# EAGLE design Test Board (EAGLE 9.2.0)
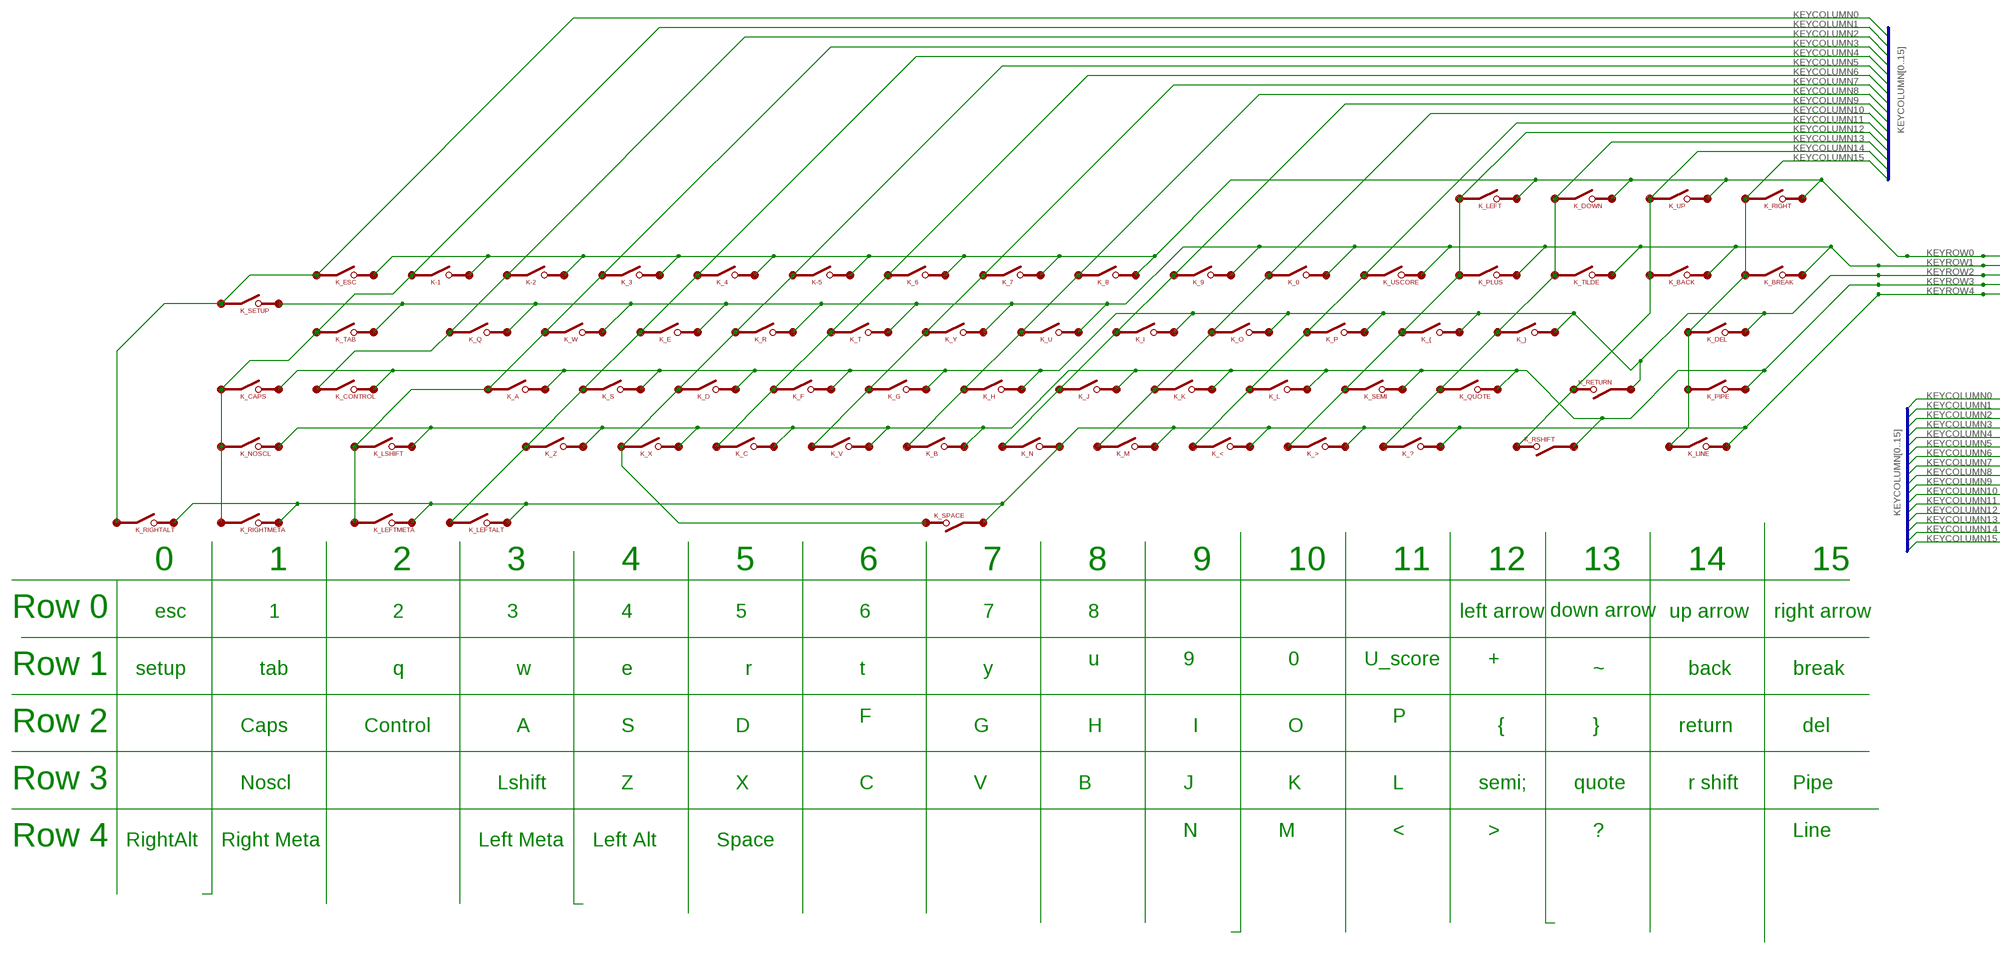
[diagram p0: schematic, sheet 1, part 1 of 2]
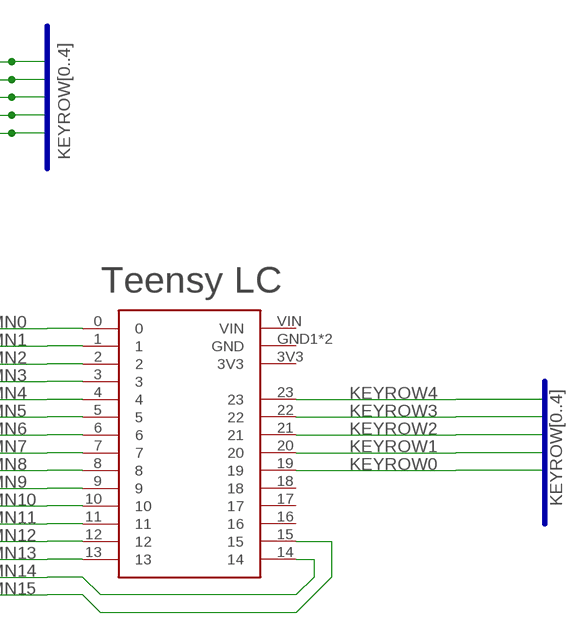
[diagram p1: schematic, sheet 1, part 2 of 2]

## Parts
K-1  1U_PAD  [SILICONE_SWITCH]
K-2  1U_PAD  [SILICONE_SWITCH]
K-5  1U_PAD  [SILICONE_SWITCH]
K_0  1U_PAD  [SILICONE_SWITCH]
K_3  1U_PAD  [SILICONE_SWITCH]
K_4  1U_PAD  [SILICONE_SWITCH]
K_6  1U_PAD  [SILICONE_SWITCH]
K_7  1U_PAD  [SILICONE_SWITCH]
K_8  1U_PAD  [SILICONE_SWITCH]
K_9  1U_PAD  [SILICONE_SWITCH]
K_<  1U_PAD  [SILICONE_SWITCH]
K_>  1U_PAD  [SILICONE_SWITCH]
K_?  1U_PAD  [SILICONE_SWITCH]
K_A  1U_PAD  [SILICONE_SWITCH]
K_B  1U_PAD  [SILICONE_SWITCH]
K_BACK  1U_PAD  [SILICONE_SWITCH]
K_BREAK  1U_PAD  [SILICONE_SWITCH]
K_C  1U_PAD  [SILICONE_SWITCH]
K_CAPS  1U_PAD  [SILICONE_SWITCH]
K_CONTROL  2U_PAD  [SILICONE_SWITCH_2U]
K_D  1U_PAD  [SILICONE_SWITCH]
K_DEL  1U_PAD  [SILICONE_SWITCH]
K_DOWN  1U_PAD  [SILICONE_SWITCH]
K_E  1U_PAD  [SILICONE_SWITCH]
K_ESC  1U_PAD  [SILICONE_SWITCH]
K_F  1U_PAD  [SILICONE_SWITCH]
K_G  1U_PAD  [SILICONE_SWITCH]
K_H  1U_PAD  [SILICONE_SWITCH]
K_I  1U_PAD  [SILICONE_SWITCH]
K_J  1U_PAD  [SILICONE_SWITCH]
K_K  1U_PAD  [SILICONE_SWITCH]
K_L  1U_PAD  [SILICONE_SWITCH]
K_LEFT  1U_PAD  [SILICONE_SWITCH]
K_LEFTALT  1U_PAD  [SILICONE_SWITCH]
K_LEFTMETA  1U_PAD  [SILICONE_SWITCH]
K_LINE  1U_PAD  [SILICONE_SWITCH]
K_LSHIFT  2U_PAD  [SILICONE_SWITCH_2U]
K_M  1U_PAD  [SILICONE_SWITCH]
K_N  1U_PAD  [SILICONE_SWITCH]
K_NOSCL  1U_PAD  [SILICONE_SWITCH]
K_O  1U_PAD  [SILICONE_SWITCH]
K_P  1U_PAD  [SILICONE_SWITCH]
K_PIPE  1U_PAD  [SILICONE_SWITCH]
K_PLUS  1U_PAD  [SILICONE_SWITCH]
K_Q  1U_PAD  [SILICONE_SWITCH]
K_QUOTE  1U_PAD  [SILICONE_SWITCH]
K_R  1U_PAD  [SILICONE_SWITCH]
K_RETURN  RETURN_PAD  [SILICONE_RETURN]
K_RIGHT  1U_PAD  [SILICONE_SWITCH]
K_RIGHTALT  1U_PAD  [SILICONE_SWITCH]
K_RIGHTMETA  1U_PAD  [SILICONE_SWITCH]
K_RSHIFT  2U_PAD  [SILICONE_SWITCH_2U]
K_S  1U_PAD  [SILICONE_SWITCH]
K_SEMI  1U_PAD  [SILICONE_SWITCH]
K_SETUP  2U_PAD  [SILICONE_SWITCH_2U]
K_SPACE  SPACE_PAD  [SILICONE_SPACE]
K_T  1U_PAD  [SILICONE_SWITCH]
K_TAB  1U_PAD  [SILICONE_SWITCH]
K_TILDE  1U_PAD  [SILICONE_SWITCH]
K_U  1U_PAD  [SILICONE_SWITCH]
K_UP  1U_PAD  [SILICONE_SWITCH]
K_USCORE  1U_PAD  [SILICONE_SWITCH]
K_V  1U_PAD  [SILICONE_SWITCH]
K_W  1U_PAD  [SILICONE_SWITCH]
K_X  1U_PAD  [SILICONE_SWITCH]
K_Y  1U_PAD  [SILICONE_SWITCH]
K_Z  1U_PAD  [SILICONE_SWITCH]
K_{  1U_PAD  [SILICONE_SWITCH]
K_}  1U_PAD  [SILICONE_SWITCH]
U$1  TEENSYLC  [2X14]

## Nets
KEYCOLUMN0: K_ESC.P$2 K_RIGHTALT.P$2 K_SETUP.P$2 U$1.0
KEYCOLUMN1: K-1.P$2 K_CAPS.P$2 K_NOSCL.P$2 K_RIGHTMETA.P$2 K_TAB.P$2 U$1.1
KEYCOLUMN2: K-2.P$2 K_CONTROL.P$2 K_Q.P$2 U$1.2
KEYCOLUMN3: K_3.P$2 K_A.P$2 K_LEFTMETA.P$2 K_LSHIFT.P$2 K_W.P$2 U$1.3
KEYCOLUMN4: K_4.P$2 K_E.P$2 K_LEFTALT.P$2 K_S.P$2 K_Z.P$2 U$1.4
KEYCOLUMN5: K-5.P$2 K_D.P$2 K_R.P$2 K_SPACE.P$1 K_X.P$2 U$1.5
KEYCOLUMN6: K_6.P$2 K_C.P$2 K_F.P$2 K_T.P$2 U$1.6
KEYCOLUMN7: K_7.P$2 K_G.P$2 K_V.P$2 K_Y.P$2 U$1.7
KEYCOLUMN8: K_8.P$2 K_B.P$2 K_H.P$2 K_U.P$2 U$1.8
KEYCOLUMN9: K_9.P$2 K_I.P$2 K_J.P$2 K_N.P$2 U$1.9
KEYCOLUMN10: K_0.P$2 K_K.P$2 K_M.P$2 K_O.P$2 U$1.10
KEYCOLUMN11: K_<.P$2 K_L.P$2 K_P.P$2 K_USCORE.P$2 U$1.11
KEYCOLUMN12: K_>.P$2 K_LEFT.P$2 K_PLUS.P$2 K_SEMI.P$2 K_{.P$2 U$1.12
KEYCOLUMN13: K_?.P$2 K_DOWN.P$2 K_QUOTE.P$2 K_TILDE.P$2 K_}.P$2 U$1.13
KEYCOLUMN14: K_BACK.P$2 K_RETURN.P$1 K_RSHIFT.P$1 K_UP.P$2 U$1.14
KEYCOLUMN15: K_BREAK.P$2 K_DEL.P$2 K_LINE.P$2 K_PIPE.P$2 K_RIGHT.P$2 U$1.15
KEYROW0: K-1.P$1 K-2.P$1 K-5.P$1 K_3.P$1 K_4.P$1 K_6.P$1 K_7.P$1 K_8.P$1 K_DOWN.P$1 K_ESC.P$1 K_LEFT.P$1 K_RIGHT.P$1 K_UP.P$1 U$1.19
KEYROW1: K_0.P$1 K_9.P$1 K_BACK.P$1 K_BREAK.P$1 K_E.P$1 K_PLUS.P$1 K_Q.P$1 K_R.P$1 K_SETUP.P$1 K_T.P$1 K_TAB.P$1 K_TILDE.P$1 K_U.P$1 K_USCORE.P$1 K_W.P$1 K_Y.P$1 U$1.20
KEYROW2: K_A.P$1 K_CAPS.P$1 K_CONTROL.P$1 K_D.P$1 K_DEL.P$1 K_F.P$1 K_G.P$1 K_H.P$1 K_I.P$1 K_O.P$1 K_P.P$1 K_RETURN.P$2 K_S.P$1 K_{.P$1 K_}.P$1 U$1.21
KEYROW3: K_B.P$1 K_C.P$1 K_J.P$1 K_K.P$1 K_L.P$1 K_LSHIFT.P$1 K_NOSCL.P$1 K_PIPE.P$1 K_QUOTE.P$1 K_RSHIFT.P$2 K_SEMI.P$1 K_V.P$1 K_X.P$1 K_Z.P$1 U$1.22
KEYROW4: K_<.P$1 K_>.P$1 K_?.P$1 K_LEFTALT.P$1 K_LEFTMETA.P$1 K_LINE.P$1 K_M.P$1 K_N.P$1 K_RIGHTALT.P$1 K_RIGHTMETA.P$1 K_SPACE.P$2 U$1.23
Unconnected: U$1.3V3 U$1.16 U$1.17 U$1.18 U$1.GND1(GND) U$1.GND2(GND) U$1.VIN

## Buses
KEYCOLUMN[0..15]
KEYROW[0..4]

## Notes on the sheet
- Teensy LC
- 0 | 1 | 2 | 3 | 4 | 5 | 6 | 7 | 8 | 9 | 10 | 11 | 12 | 13 | 14 | 15
- Row 0 | esc | 1 | 2 | 3 | 4 | 5 | 6 | 7 | 8 | left arrow | down arrow | up arrow | right arrow
- u | 9 | 0 | U_score | +
- Row 1 | setup | tab | q | w | e | r | t | y | ~ | back | break
- F | P
- Row 2 | Caps | Control | A | S | D | G | H | I | O | { | } | return | del
- Row 3 | Noscl | Lshift | Z | X | C | V | B | J | K | L | semi; | quote | r shift | Pipe
- N | M | < | > | ? | Line
- Row 4 | RightAlt | Right Meta | Left Meta | Left Alt | Space

## Library data of the parts
K-1 K-2 K-5 K_0 K_3 K_4 K_6-K_9 K_< K_> K_? K_A K_B K_BACK K_BREAK K_C K_CAPS K_D K_DEL K_DOWN K_E K_ESC K_F K_G K_H K_I K_J K_K K_L K_LEFT K_LEFTALT K_LEFTMETA K_LINE K_M K_N K_NOSCL K_O K_P K_PIPE K_PLUS K_Q K_QUOTE K_R K_RIGHT K_RIGHTALT K_RIGHTMETA K_S K_SEMI K_T K_TAB K_TILDE K_U K_UP K_USCORE K_V K_W K_X K_Y K_Z K_{ K_} = SiliconeSwitches:1U_PAD
K_CONTROL K_LSHIFT K_RSHIFT K_SETUP = SiliconeSwitches:2U_PAD
K_RETURN = SiliconeSwitches:RETURN_PAD
K_SPACE = SiliconeSwitches:SPACE_PAD
U$1 = SiliconeSwitches:TEENSYLC

## Board
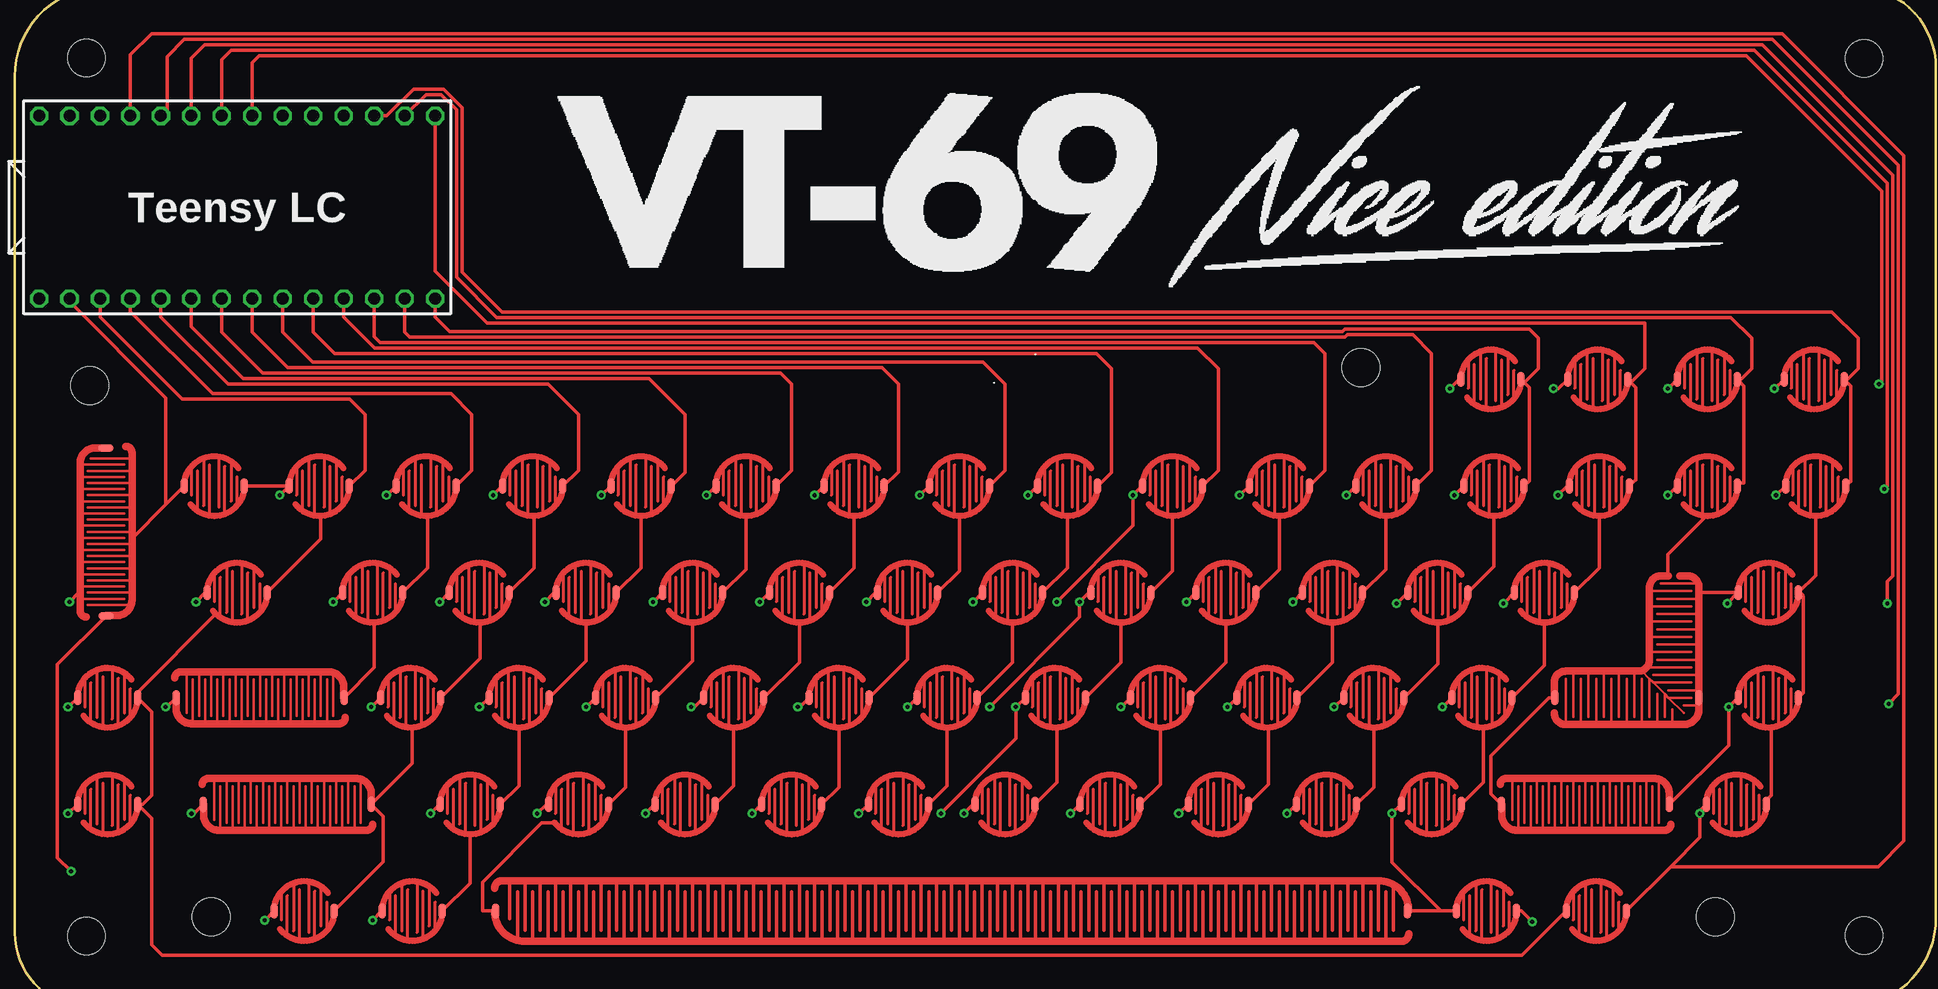
[diagram p2: board, top side]
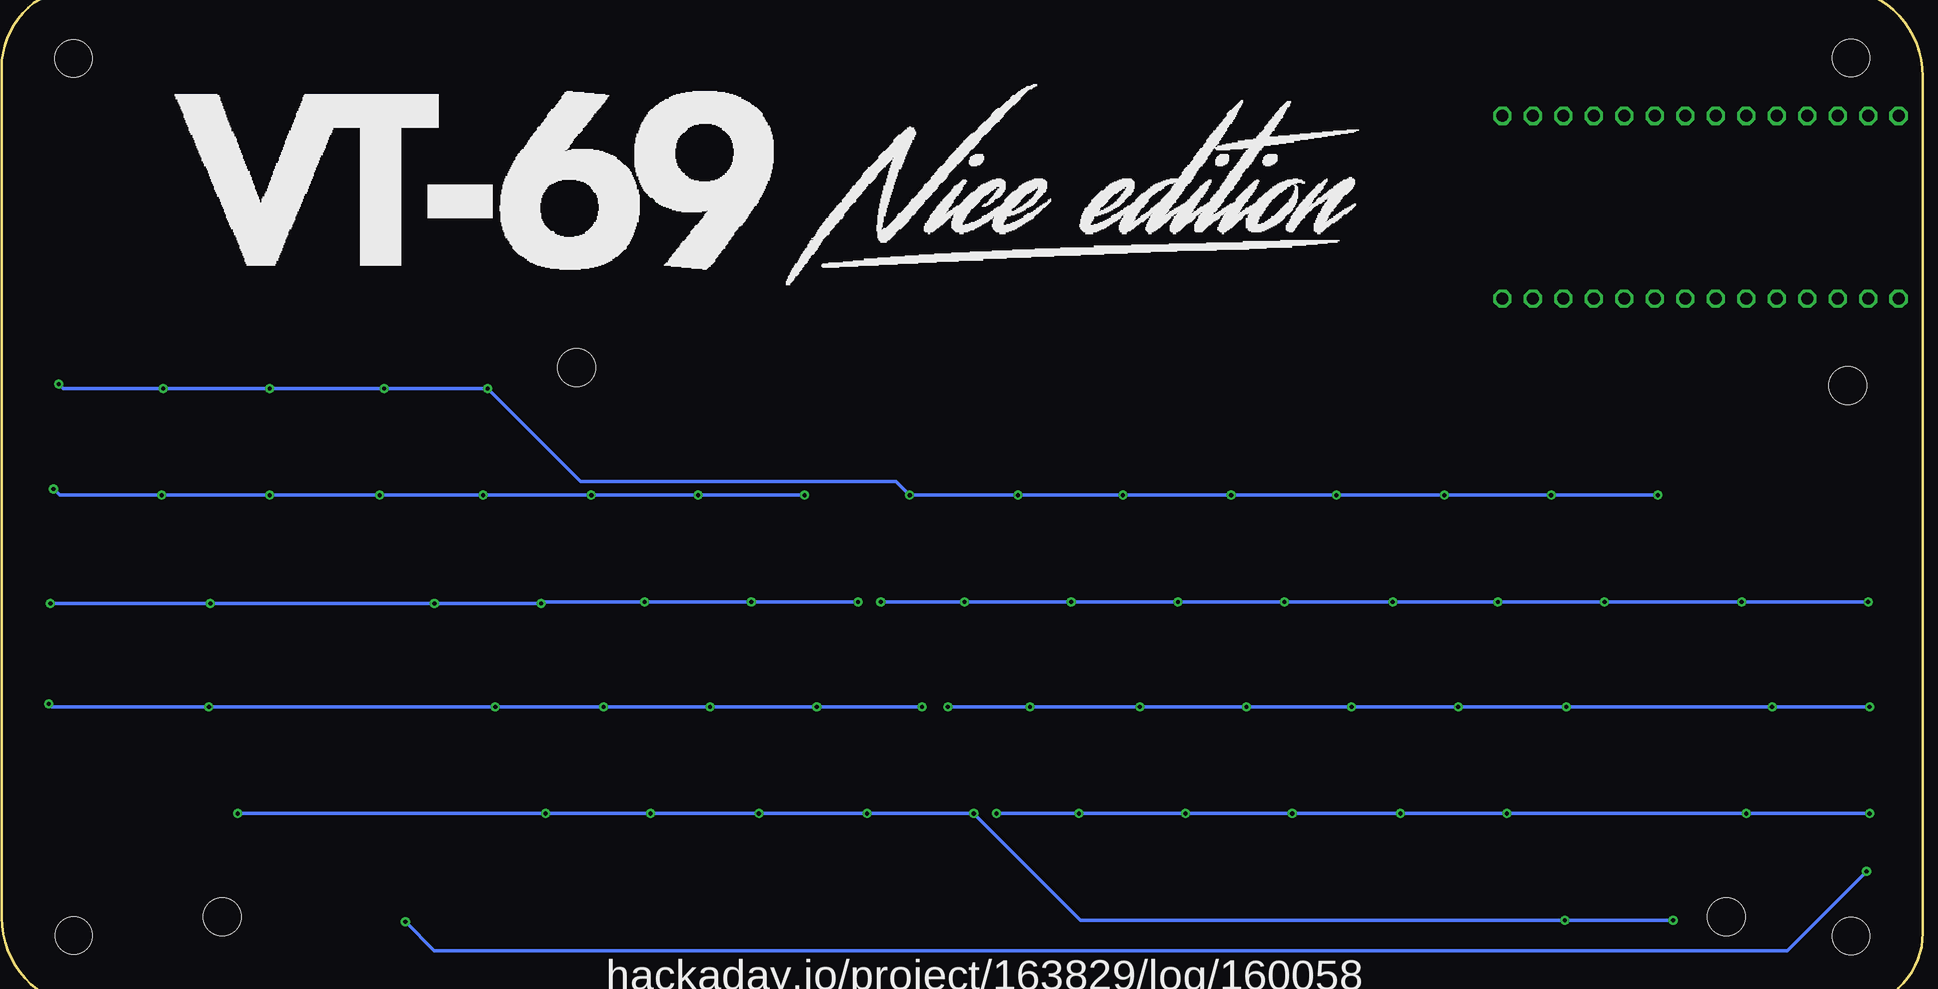
[diagram p3: board, bottom side, seen from below]

No outline drawn. Coordinates in mm, seen from the top.
Copper layers (1*16): Top 0.035mm / dielectric 1.5mm / Bottom 0.035mm
Design rules "default *": minimum track width 6mil, minimum drill 0.35mm, track to track 6mil, track to pad 6mil, pad to pad 6mil, via to via 6mil, smd to smd 6mil, copper to edge 40mil, drill to drill 6mil, minimum pad ring 10mil, minimum via ring 8mil, stop-mask expansion 4mil, vias tented up to drill 25mil, thermal gap 10mil
Holes 3.1 mm at 8.53,8.58 8.54,81.78 156.69,81.75 156.68,8.61
Holes 3.15 mm at 114.76,55.98 144.3,10.2 18.91,10.19 8.79,54.48
Milling: 8 lines

### Footprints (pad centres in the part's own frame; a part is rotated, then mirrored left to right if it is on the bottom)
SILICONE_SWITCH = smd 0.635 x 1.27: P$1 -2.5,0; P$2 2.5,0
SILICONE_SWITCH_2U = smd 0.635 x 1.27: P$1 -7,0; P$2 7,0
SILICONE_RETURN = smd 0.635 x 1.27: P$1 -6,0; P$2 6,0
SILICONE_SPACE = smd 0.635 x 1.27: P$1 -38,0; P$2 38,0
2X14 = drill 1 octagon: 0 -13.97,-7.62; 1 -11.43,-7.62; 2 -8.89,-7.62; 3 -6.35,-7.62; 3V3 -11.43,7.62; 4 -3.81,-7.62; 5 -1.27,-7.62; 6 1.27,-7.62; 7 3.81,-7.62; 8 6.35,-7.62; 9 8.89,-7.62; 10 11.43,-7.62; 11 13.97,-7.62; 12 16.51,-7.62; 13 16.51,7.62; 14 13.97,7.62; 15 11.43,7.62; 16 8.89,7.62; 17 6.35,7.62; 18 3.81,7.62; 19 1.27,7.62; 20 -1.27,7.62; 21 -3.81,7.62; 22 -6.35,7.62; 23 -8.89,7.62; GND1 -16.51,-7.62; GND2 -13.97,7.62; VIN -16.51,7.62

### Placement (x,y rotation side)
K-1  27.94,46.1 0 top
K-2  36.83,46.1 0 top
K-5  63.5,46.1 0 top
K_0  107.95,46.1 0 top
K_3  45.72,46.1 0 top
K_4  54.74,46.1 0 top
K_6  72.52,46.1 0 top
K_7  81.28,46.1 0 top
K_8  90.3,46.1 0 top
K_9  99.06,46.1 0 top
K_<  102.87,19.56 0 top
K_>  111.89,19.56 0 top
K_?  120.65,19.56 0 top
K_A  35.56,28.45 0 top
K_B  76.2,19.56 0 top
K_BACK  143.64,46.1 0 top
K_BREAK  152.65,46.1 0 top
K_C  58.42,19.56 0 top
K_CAPS  10.29,28.45 0 top
K_CONTROL  22.99,28.45 0 top
K_D  53.47,28.45 0 top
K_DEL  148.72,37.21 0 top
K_DOWN  134.49,54.99 0 top
K_E  50.16,37.21 0 top
K_ESC  19.18,46.1 180 top
K_F  62.48,28.45 0 top
K_G  71.25,28.45 0 top
K_H  80.26,28.45 0 top
K_I  94.74,37.21 0 top
K_J  89.28,28.45 0 top
K_K  98.04,28.45 0 top
K_L  106.93,28.45 0 top
K_LEFT  125.6,54.99 0 top
K_LEFTALT  35.69,10.67 0 top
K_LEFTMETA  26.67,10.67 0 top
K_LINE  146.05,19.56 0 top
K_LSHIFT  25.27,19.56 0 top
K_M  93.85,19.56 0 top
K_N  85.09,19.56 0 top
K_NOSCL  10.29,19.56 0 top
K_O  103.5,37.21 0 top
K_P  112.39,37.21 0 top
K_PIPE  148.72,28.45 0 top
K_PLUS  125.86,46.1 0 top
K_Q  32.38,37.21 0 top
K_QUOTE  124.84,28.45 0 top
K_R  59.05,37.21 0 top
K_RETURN  136.91,28.45 0 top
K_RIGHT  152.53,54.99 0 top
K_RIGHTALT  125.22,10.67 0 top
K_RIGHTMETA  134.37,10.67 180 top
K_RSHIFT  133.48,19.56 0 top
K_S  44.58,28.45 0 top
K_SEMI  115.82,28.45 0 top
K_SETUP  10.16,42.29 270 top
K_SPACE  80.64,10.67 0 top
K_T  67.94,37.21 0 top
K_TAB  21.08,37.21 0 top
K_TILDE  134.62,46.1 0 top
K_U  85.72,37.21 0 top
K_UP  143.64,54.99 0 top
K_USCORE  116.84,46.1 0 top
K_V  67.31,19.56 0 top
K_W  41.27,37.21 0 top
K_X  49.53,19.56 0 top
K_Y  76.96,37.21 0 top
K_Z  40.51,19.56 0 top
K_{  121.16,37.21 0 top
K_}  130.05,37.21 0 top
U$1  21.08,69.34 0 top

### Tracks (layer width: path | path; a pad name or v marks a point on that pad's centre or on a via)
KEYCOLUMN0  (via drill 0.35)
  Top 0.305: K_ESC.P$2 15.13,44.56 | 15.13,44.56 12.32,41.74 12.32,36.58 arc-90 11.05,35.31 10.18,35.31 arc90 K_SETUP.P$2 6.1,31.23 6.1,15.11 v7.24,13.97 | v129.03,9.78 128.14,10.67 K_RIGHTALT.P$2 | 15.13,44.56 15.13,53.45 7.11,61.47 U$1.0
  Bottom 0.305: v7.24,13.97 13.84,7.37 126.62,7.37 v129.03,9.78
KEYCOLUMN1
  Top 0.305: K_RIGHTMETA.P$2 128.18,6.99 14.86,6.99 13.97,7.87 13.97,18.38 K_NOSCL.P$2 13.21,19.56 13.97,20.32 13.97,27.27 K_CAPS.P$2 12.83,28.49 12.83,28.96 19.25,35.38 19.25,35.43 19.25,35.31 20.07,34.92 arc90 20.19,34.8 21.21,34.8 arc90 23.58,37.17 K_TAB.P$2 28.07,41.7 28.07,43.56 28.27,43.56 28.4,43.69 arc2 29.46,44.07 arc48 30.1,44.7 arc5 30.23,45.09 arc8 K-1.P$2 31.75,47.41 31.75,52.07 30.48,53.34 16.51,53.34 9.65,60.2 U$1.1
KEYCOLUMN2
  Top 0.305: K_CONTROL.P$2 32.51,30.97 32.51,34.67 arc90 34.88,37.04 K_Q.P$2 36.96,39.28 36.96,43.69 arc90 39.33,46.06 K-2.P$2 40.64,47.41 40.64,52.07 38.91,53.8 19.05,53.8 12.19,60.66 U$1.2
KEYCOLUMN3
  Top 0.305: 35.69,26.04 35.69,25.91 | 35.69,25.91 35.69,22.97 K_LSHIFT.P$2 33.27,18.56 33.27,14.77 K_LEFTMETA.P$2 | 35.69,25.91 arc90 38.06,28.28 K_A.P$2 41.33,31.71 41.33,34.8 41.36,34.8 arc90 K_W.P$2 45.85,39.28 45.85,43.56 arc90 48.22,45.93 K_3.P$2 49.53,47.41 49.53,52.07 46.99,54.61 20.32,54.61 14.73,60.2 U$1.3
KEYCOLUMN4
  Top 0.305: K_LEFTALT.P$2 40.51,12.99 40.51,17.02 arc90 43.01,19.52 K_Z.P$2 44.58,21.12 44.58,26.04 44.66,26.04 arc90 K_S.P$2 50.16,31.54 50.16,34.67 arc90 52.66,37.17 K_E.P$2 54.74,39.28 54.74,43.56 arc90 57.24,46.06 | K_4.P$2 57.24,46.06 | U$1.4 17.27,59.38 21.59,55.07 55.42,55.07 58.42,52.07 58.42,47.24 57.24,46.06
KEYCOLUMN5
  Top 0.305: K_SPACE.P$1 41.53,10.67 41.53,13.08 46.48,18.03 47.5,18.03 47.75,17.78 48.26,17.4 49.02,17.14 49.53,17.02 arc90 52.03,19.52 K_X.P$2 53.47,21 53.47,25.91 arc90 55.97,28.41 K_D.P$2 59.05,31.54 59.05,34.67 arc90 61.55,37.17 K_R.P$2 63.5,39.16 63.5,43.56 arc90 66,46.06 K-5.P$2 67.31,47.41 67.31,54.61 66.4,55.52 23.22,55.52 19.81,58.93 U$1.5
KEYCOLUMN6
  Top 0.305: K_C.P$2 62.48,21.12 62.48,25.91 arc90 64.98,28.41 K_F.P$2 67.94,31.41 67.94,34.8 68.03,34.8 arc90 K_T.P$2 72.52,39.28 72.52,43.56 arc90 75.02,46.06 K_6.P$2 76.2,47.28 76.2,54.61 74.83,55.98 25.3,55.98 22.35,58.93 U$1.6
KEYCOLUMN7
  Top 0.305: K_V.P$2 71.25,21 71.25,25.91 arc90 73.75,28.41 K_G.P$2 76.96,31.66 76.96,34.67 arc90 79.46,37.17 K_Y.P$2 81.28,39.03 81.28,43.56 arc90 83.78,46.06 K_7.P$2 85.09,47.41 85.09,54.61 83.26,56.44 27.38,56.44 24.89,58.93 U$1.7
KEYCOLUMN8
  Top 0.305: K_B.P$2 80.26,21.12 80.26,26.04 80.35,26.04 arc90 K_H.P$2 85.72,31.41 85.72,34.67 arc90 88.22,37.17 K_U.P$2 90.3,39.28 90.3,43.56 arc90 92.8,46.06 | K_8.P$2 92.8,46.06 | U$1.8 27.43,58.93 29.21,57.15 92.71,57.15 93.98,55.88 93.98,47.24 92.8,46.06
KEYCOLUMN9
  Top 0.305: K_N.P$2 89.41,21.38 89.41,25.91 arc90 91.78,28.28 K_J.P$2 94.74,31.41 94.74,34.8 94.83,34.8 arc90 K_I.P$2 99.06,39.03 99.06,43.69 99.15,43.69 arc90 K_9.P$2 102.87,47.41 102.87,55.88 101.14,57.61 32.56,57.61 29.97,60.2 U$1.9
KEYCOLUMN10
  Top 0.305: K_M.P$2 98.04,21.25 98.04,26.04 98.13,26.04 arc90 K_K.P$2 103.5,31.41 103.5,34.67 arc90 106,37.17 K_O.P$2 107.95,39.16 107.95,43.69 108.04,43.69 arc90 K_0.P$2 111.76,47.41 111.76,57.15 110.85,58.06 33.02,58.06 32.51,58.57 U$1.10
KEYCOLUMN11
  Top 0.305: K_<.P$2 107.06,21.25 107.06,25.91 arc90 109.43,28.28 K_L.P$2 112.39,31.41 112.39,34.67 arc90 114.89,37.17 K_P.P$2 116.84,39.16 116.84,43.56 arc90 119.34,46.06 K_USCORE.P$2 120.65,47.41 120.65,57.15 119.08,58.72 113.62,58.72 113.42,58.52 35.46,58.52 35.05,58.93 U$1.11
KEYCOLUMN12
  Top 0.305: K_>.P$2 115.82,21 115.82,26.04 115.91,26.04 arc90 K_SEMI.P$2 121.16,31.28 121.16,34.67 arc90 123.66,37.17 K_{.P$2 125.86,39.41 125.86,43.56 arc90 128.36,46.06 K_PLUS.P$2 128.78,46.52 128.78,54.32 128.38,54.72 | 128.38,54.72 K_LEFT.P$2 | U$1.12 37.59,60.2 38.81,58.98 113.23,58.98 113.43,59.18 128.78,59.18 129.54,58.42 129.54,55.88 128.38,54.72
KEYCOLUMN13
  Top 0.305: K_DOWN.P$2 137.27,54.72 | 137.27,54.72 137.67,54.32 137.67,46.61 137.63,46.61 K_TILDE.P$2 137.12,46.06 arc-90 134.62,43.56 134.62,39.28 K_}.P$2 arc-90 130.13,34.8 130.05,34.8 130.05,31.16 K_QUOTE.P$2 127.34,28.41 arc-90 124.97,26.04 124.97,21.38 K_?.P$2 | U$1.13 37.59,64.01 41.91,59.69 138.43,59.69 138.43,55.88 137.27,54.72
KEYCOLUMN14
  Top 0.305: K_UP.P$2 146.28,54.84 | 146.28,54.84 146.69,54.44 146.69,46.35 146.39,46.35 K_BACK.P$2 arc-90 143.72,43.69 143.64,43.69 140.34,40.39 140.34,38.61 139.7,38.61 arc90 138.81,37.72 138.81,31.5 arc-90 137.92,30.61 131.83,30.61 arc90 130.94,29.72 130.94,28.48 arc-90 K_RETURN.P$1 130.43,28.45 125.6,23.62 125.6,20.43 K_RSHIFT.P$1 | U$1.14 36.83,78.74 38.1,78.74 39.37,77.47 39.37,63.5 42.72,60.15 145.59,60.15 147.32,58.42 147.32,55.88 146.28,54.84
KEYCOLUMN15
  Top 0.305: K_RIGHT.P$2 155.17,54.84 | 155.17,54.84 155.57,54.44 155.57,46.48 155.53,46.48 K_BREAK.P$2 arc-90 152.74,43.69 152.65,43.69 152.65,38.65 K_DEL.P$2 arc-90 151.64,36.79 151.64,28.87 K_PIPE.P$2 151.22,28.28 arc-90 148.84,25.91 | K_LINE.P$2 148.55,19.9 148.97,20.32 148.97,25.78 148.84,25.91 | 148.84,25.91 148.72,26.04 | U$1.15 33.55,76.96 35.79,79.2 38.29,79.2 39.83,77.66 39.83,63.96 43.18,60.6 154.03,60.6 156.21,58.42 156.21,55.88 155.17,54.84
KEYROW0  (via drill 0.35)
  Top 0.305: K_ESC.P$1 K-1.P$1 24.68,45.34 v24.64,45.34 | v33.53,45.34 33.57,45.34 K-2.P$1 | v42.42,45.34 43.18,46.1 K_3.P$1 | K_4.P$1 51.48,45.34 v51.44,45.34 | K-5.P$1 60.24,45.34 v60.2,45.34 | K_6.P$1 69.25,45.34 v69.22,45.34 | K_7.P$1 78.02,45.34 v77.98,45.34 | K_8.P$1 87.03,45.34 v87,45.34 | K_RIGHT.P$1 149.26,54.23 v149.22,54.23 | K_UP.P$1 140.38,54.23 v140.34,54.23 | K_DOWN.P$1 131.23,54.23 v130.81,54.23 | K_LEFT.P$1 122.94,54.99 v122.17,54.23 | U$1.19 22.35,81.41 22.94,81.99 146.86,81.99 158.17,70.69 158.17,54.79 157.99,54.61 v157.94,54.61
  Bottom 0.305: v24.64,45.34 v33.53,45.34 | v33.53,45.34 33.66,45.34 v33.53,45.34 | v33.53,45.34 v42.42,45.34 v51.44,45.34 v60.2,45.34 v69.22,45.34 v77.98,45.34 v87,45.34 88.14,46.48 114.43,46.48 v122.17,54.23 v130.81,54.23 v140.34,54.23 v149.22,54.23 157.56,54.23 v157.94,54.61
KEYROW1  (via drill 0.35)
  Top 0.305: K_Y.P$1 74.3,37.21 v73.53,36.45 | K_U.P$1 82.46,36.45 v82.42,36.45 | K_T.P$1 64.68,36.45 v64.64,36.45 | K_R.P$1 55.79,36.45 v55.75,36.45 | K_E.P$1 47.5,37.21 v46.74,36.45 | K_W.P$1 38.01,36.45 v37.97,36.45 | K_Q.P$1 29.12,36.45 v29.08,36.45 | K_TAB.P$1 18.41,37.21 v17.65,36.45 | K_SETUP.P$1 9.14,49.28 arc94 8,48.01 8,37.21 7.87,37.21 v7.11,36.45 | K_0.P$1 104.69,45.34 v104.65,45.34 | K_9.P$1 96.52,46.1 v95.76,45.34 95.76,42.8 v89.41,36.45 | K_USCORE.P$1 113.58,45.34 v113.54,45.34 | K_PLUS.P$1 122.59,45.34 v122.56,45.34 | K_TILDE.P$1 131.95,46.1 v131.19,45.34 | K_BACK.P$1 140.38,45.34 v140.34,45.34 | K_BREAK.P$1 149.39,45.34 v149.35,45.34 | U$1.20 19.81,81.66 20.6,82.45 147.55,82.45 158.62,71.37 158.62,46.1 v158.37,45.85
  Bottom 0.305: v7.11,36.45 v17.65,36.45 v29.08,36.45 v37.97,36.45 v46.74,36.45 v55.75,36.45 v64.64,36.45 v73.53,36.45 v82.42,36.45 v89.41,36.45 | v95.76,45.34 v104.65,45.34 v113.54,45.34 v122.56,45.34 v131.19,45.34 v140.34,45.34 v149.35,45.34 157.86,45.34 v158.37,45.85
KEYROW2  (via drill 0.35)
  Top 0.305: K_RETURN.P$2 142.88,28.48 142.88,37.21 K_DEL.P$1 146.18,37.21 v145.29,36.32 | K_}.P$1 126.66,36.32 v126.62,36.32 | K_{.P$1 117.77,36.32 v117.73,36.32 | K_P.P$1 109.13,36.45 v109.09,36.45 | K_O.P$1 100.24,36.45 v100.2,36.45 | K_I.P$1 92.08,37.21 v91.31,36.45 91.31,35.18 v83.82,27.69 | K_CAPS.P$1 7.03,27.69 v6.99,27.69 | K_H.P$1 77,27.69 v76.96,27.69 | K_G.P$1 67.98,27.69 v67.82,27.69 | K_F.P$1 59.22,27.69 v58.93,27.69 | K_D.P$1 50.2,27.69 v50.16,27.69 | K_S.P$1 41.31,27.69 v41.27,27.69 | K_A.P$1 32.3,27.69 v32.26,27.69 | K_CONTROL.P$1 15.22,27.69 v15.11,27.69 | U$1.21 17.27,81.79 18.39,82.91 148.23,82.91 159.11,72.03 159.11,38.61 158.62,38.12 v158.62,36.32
  Bottom 0.305: v91.31,36.45 v100.2,36.45 v109.09,36.45 117.6,36.45 v117.73,36.32 v126.62,36.32 v145.29,36.32 v158.62,36.32 | v6.99,27.69 v15.11,27.69 v32.26,27.69 v41.27,27.69 v50.16,27.69 v58.93,27.69 v67.82,27.69 v76.96,27.69 | v76.96,27.69 77.09,27.69 | v76.96,27.69 v83.82,27.69
KEYROW3  (via drill 0.35)
  Top 0.305: K_J.P$1 86.02,27.69 | 86.02,27.69 v85.98,27.69 | K_PIPE.P$1 146.18,28.45 v145.41,27.69 145.41,24.5 K_RSHIFT.P$2 | K_QUOTE.P$1 121.58,27.69 v121.54,27.69 | K_SEMI.P$1 112.56,27.69 v112.52,27.69 | K_L.P$1 103.67,27.69 v103.63,27.69 | K_K.P$1 94.78,27.69 v94.74,27.69 | K_NOSCL.P$1 7.03,18.8 v6.99,18.8 | v64.01,18.8 64.05,18.8 K_V.P$1 | K_C.P$1 55.88,19.56 v55.12,18.8 | K_X.P$1 46.86,19.56 v46.1,18.8 | K_Z.P$1 37.97,19.56 v37.21,18.8 | K_LSHIFT.P$1 17.51,18.8 v17.27,18.8 | K_B.P$1 72.94,18.8 v72.9,18.8 | v79.76,18.8 86.02,25.06 86.02,27.69 | U$1.22 15.24,77.47 15.24,81.92 16.69,83.36 149.05,83.36 159.56,72.85 159.56,29.21 159.56,28.75 v158.75,27.94
  Bottom 0.305: v85.98,27.69 v94.74,27.69 v103.63,27.69 v112.52,27.69 v121.54,27.69 v145.41,27.69 158.5,27.69 v158.75,27.94 | v6.99,18.8 v17.27,18.8 v37.21,18.8 v46.1,18.8 v55.12,18.8 v64.01,18.8 v72.9,18.8 v79.76,18.8
KEYROW4  (via drill 0.35)
  Top 0.305: K_LINE.P$1 143,19.01 v143,18.8 143,16.8 140.57,14.37 | K_N.P$1 82.42,19.56 v81.66,18.8 | K_?.P$1 118.11,19.56 v117.35,18.8 117.35,14.73 121.41,10.67 | K_>.P$1 108.62,18.8 v108.58,18.8 | K_<.P$1 99.61,18.8 v99.57,18.8 | K_M.P$1 90.59,18.8 v90.55,18.8 | K_LEFTMETA.P$1 23.41,9.91 v23.37,9.91 | v32.38,9.91 33.15,10.67 K_LEFTALT.P$1 | K_RIGHTMETA.P$1 140.57,14.37 | K_SPACE.P$2 121.41,10.67 | 121.41,10.67 K_RIGHTALT.P$1 | 140.57,14.37 157.88,14.37 160.02,16.51 160.02,73.66 149.86,83.82 13.97,83.82 12.19,82.04 U$1.23
  Bottom 0.305: v143,18.8 v117.35,18.8 v108.58,18.8 v99.57,18.8 v90.55,18.8 v81.66,18.8 72.77,9.91 v32.38,9.91 v23.37,9.91

### Text on the board
bPlace: hackaday.io/project/163829/log/160058